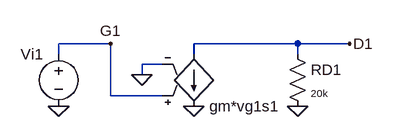
[diagram p0: schematic DifferentialAmplifierSmallSignalPiSingle.asc]
DifferentialAmplifierSmallSignalPiSingle.asc, the LTspice schematic file:
Version 4
SHEET 1 1120 680
WIRE 128 -352 48 -352
WIRE 416 -352 256 -352
WIRE 496 -352 416 -352
WIRE 48 -336 48 -352
WIRE 256 -336 256 -352
WIRE 416 -336 416 -352
WIRE 208 -320 176 -320
WIRE 176 -304 176 -320
WIRE 128 -272 128 -352
WIRE 208 -272 128 -272
FLAG 48 -256 0
FLAG 256 -256 0
FLAG 416 -256 0
FLAG 176 -304 0
FLAG 128 -352 G1
FLAG 496 -352 D1
SYMBOL res 400 -352 R0
WINDOW 3 36 76 Left 1
SYMATTR Value 20k
SYMATTR InstName RD1
SYMBOL voltage 48 -352 M0
WINDOW 3 24 96 Invisible 2
SYMATTR InstName Vi1
SYMBOL g 256 -240 M180
WINDOW 3 24 96 Invisible 2
SYMATTR InstName gm*vg1s1

The netlist it stands for:
* DifferentialAmplifierSmallSignalPiSingle.asc
RD1 D1 0 20k
Vi1 G1 0 V
gm*vg1s1 D1 0 G1 0 G
.backanno
.end